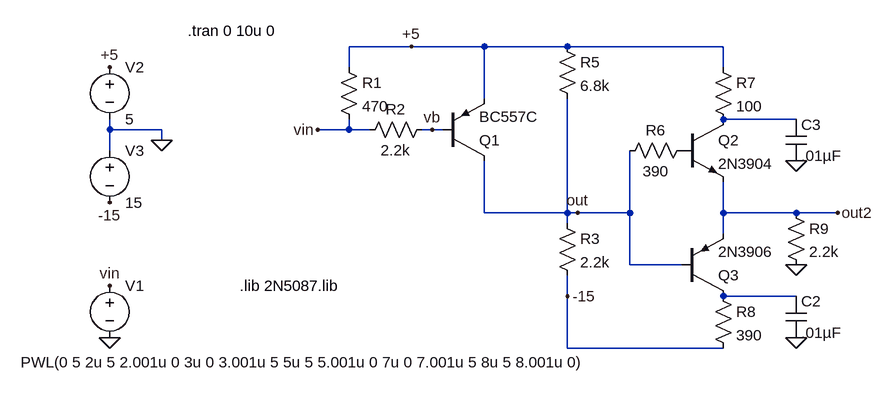
[diagram p0: schematic vc8e_intensify.asc]
vc8e_intensify.asc, the LTspice schematic file:
Version 4
SHEET 1 1048 1364
WIRE 32 112 -64 112
WIRE 144 112 32 112
WIRE 272 112 144 112
WIRE 512 112 272 112
WIRE -64 144 -64 112
WIRE 512 144 512 112
WIRE 144 192 144 112
WIRE 624 224 512 224
WIRE -432 240 -432 224
WIRE -352 240 -432 240
WIRE -64 240 -64 224
WIRE -64 240 -112 240
WIRE -32 240 -64 240
WIRE 64 240 48 240
WIRE 80 240 64 240
WIRE -352 256 -352 240
WIRE -432 272 -432 240
WIRE 144 368 144 288
WIRE 272 368 272 192
WIRE 272 368 144 368
WIRE 288 368 272 368
WIRE 368 368 368 272
WIRE 368 368 288 368
WIRE 512 368 512 320
WIRE 624 368 512 368
WIRE 688 368 624 368
WIRE 272 384 272 368
WIRE 512 400 512 368
WIRE 368 448 368 368
WIRE 448 448 368 448
WIRE 272 496 272 464
WIRE 624 496 512 496
WIRE 272 576 272 496
WIRE 512 576 272 576
FLAG -352 256 0
FLAG -432 352 -15
FLAG -432 144 +5
FLAG 32 112 +5
FLAG 288 368 out
FLAG -432 560 0
FLAG -112 240 vin
FLAG -432 480 vin
FLAG 272 496 -15
FLAG 624 448 0
FLAG 688 368 out2
FLAG 624 288 0
FLAG 624 560 0
FLAG 64 240 vb
SYMBOL voltage -432 464 R0
WINDOW 3 -137 134 Left 2
SYMATTR Value PWL(0 5 2u 5 2.001u 0 3u 0 3.001u 5 5u 5 5.001u 0 7u 0 7.001u 5 8u 5 8.001u 0)
SYMATTR InstName V1
SYMBOL voltage -432 128 R0
SYMATTR InstName V2
SYMATTR Value 5
SYMBOL voltage -432 256 R0
SYMATTR InstName V3
SYMATTR Value 15
SYMBOL res -80 128 R0
SYMATTR InstName R1
SYMATTR Value 470
SYMBOL res 64 224 R90
WINDOW 0 0 56 VBottom 2
WINDOW 3 32 56 VTop 2
SYMATTR InstName R2
SYMATTR Value 2.2k
SYMBOL pnp 80 288 M180
SYMATTR InstName Q1
SYMATTR Value BC557C
SYMBOL res 256 368 R0
SYMATTR InstName R3
SYMATTR Value 2.2k
SYMBOL res 256 96 R0
SYMATTR InstName R5
SYMATTR Value 6.8k
SYMBOL npn 448 224 R0
SYMATTR InstName Q2
SYMATTR Value 2N3904
SYMBOL pnp 448 496 M180
SYMATTR InstName Q3
SYMATTR Value 2N3906
SYMBOL res 464 256 R90
WINDOW 0 0 56 VBottom 2
WINDOW 3 32 56 VTop 2
SYMATTR InstName R6
SYMATTR Value 390
SYMBOL res 496 128 R0
SYMATTR InstName R7
SYMATTR Value 100
SYMBOL res 496 480 R0
SYMATTR InstName R8
SYMATTR Value 390
SYMBOL res 608 352 R0
SYMATTR InstName R9
SYMATTR Value 2.2k
SYMBOL cap 608 224 R0
SYMATTR InstName C3
SYMATTR Value .01µF
SYMBOL cap 608 496 R0
SYMATTR InstName C2
SYMATTR Value .01µF
TEXT -312 88 Left 2 !.tran 0 10u 0
TEXT -232 480 Left 2 !.lib 2N5087.lib

The netlist it stands for:
* vc8e_intensify.asc
V1 vin 0 PWL(0 5 2u 5 2.001u 0 3u 0 3.001u 5 5u 5 5.001u 0 7u 0 7.001u 5 8u 5 8.001u 0)
V2 +5 0 5
V3 0 -15 15
R1 +5 vin 470
R2 vb vin 2.2k
Q1 out vb +5 0 BC557C
R3 out -15 2.2k
R5 +5 out 6.8k
Q2 N001 P001 out2 0 2N3904
Q3 N002 out out2 0 2N3906
R6 P001 out 390
R7 +5 N001 100
R8 N002 -15 390
R9 out2 0 2.2k
C3 N001 0 .01µF
C2 N002 0 .01µF
.model NPN NPN
.model PNP PNP
.lib standard.bjt
.tran 0 10u 0
.lib 2N5087.lib
.backanno
.end